# EAGLE design clock (EAGLE 6.5.0)
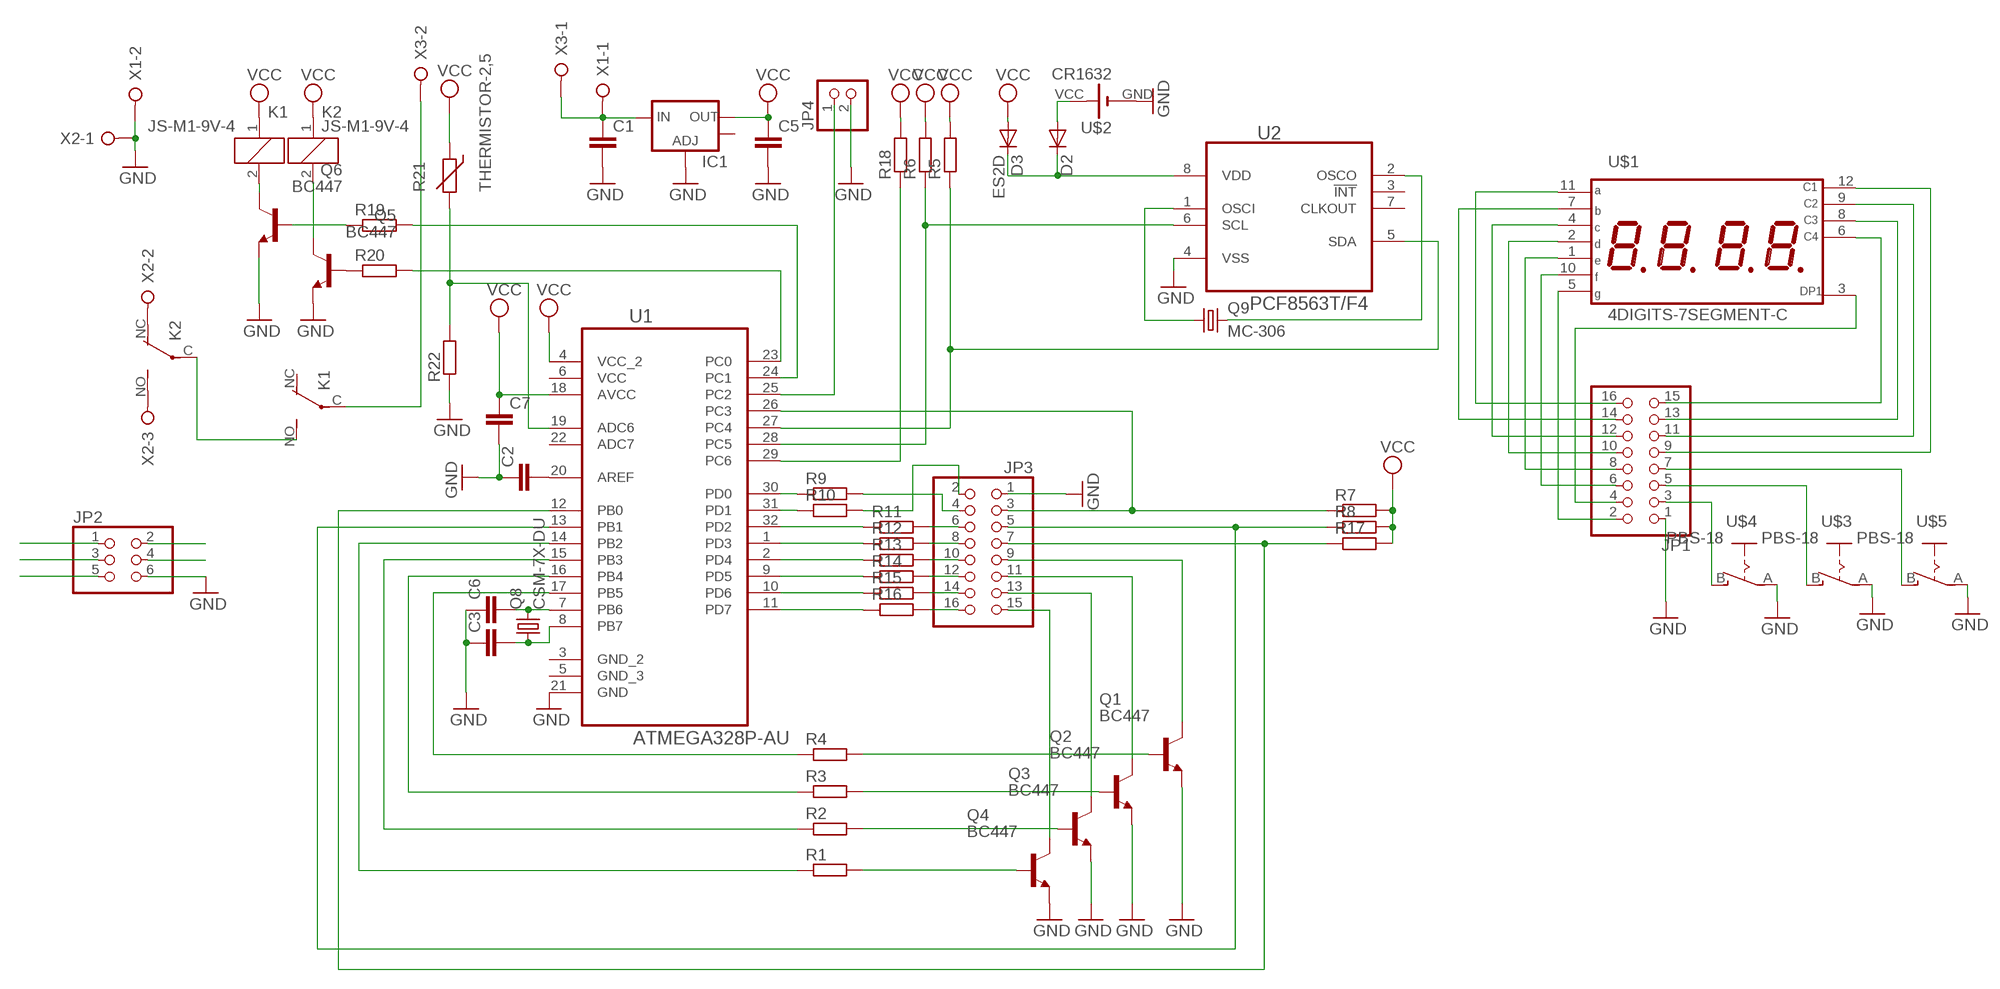
[diagram p0: schematic, sheet 1]

## Parts
C1  C-EU025-040X050  [C025-040X050]
C2  C-EUC1206  [C1206]
C3  C-EUC0805K  [C0805K]
C5  C-EU025-050X050  [C025-050X050]
C6  C-EUC0805K  [C0805K]
C7  C-EU025-040X050  [C025-040X050]
D2  DIODE-SOD80C  [SOD80C]
D3  ES2D  [SMB]
IC1  V_REG_LM1117SOT223  [SOT223]
JP1  PINHD-2X8  [2X08]
JP2  PINHD-2X3  [2X03]
JP3  PINHD-2X8  [2X08]
JP4  PINHD-1X2  [1X02]
K1  JS-M1-9V-4  [JS-M]
K2  JS-M1-9V-4  [JS-M]
Q1  BC447  [TO92-EBC]
Q2  BC447  [TO92-EBC]
Q3  BC447  [TO92-EBC]
Q4  BC447  [TO92-EBC]
Q5  BC447  [TO92-EBC]
Q6  BC447  [TO92-EBC]
Q8  CSM-7X-DU  [CSM-7X-DU]
Q9  MC-306  [MC-306]
R1  R-EU_0207/10  [0207/10]
R2  R-EU_0207/10  [0207/10]
R3  R-EU_0207/10  [0207/10]
R4  R-EU_0207/10  [0207/10]
R5  R-EU_R1206  [R1206]
R6  R-EU_R1206  [R1206]
R7  R-EU_0207/10  [0207/10]
R8  R-EU_0207/10  [0207/10]
R9  R-EU_0207/10  [0207/10]
R10  R-EU_0207/10  [0207/10]
R11  R-EU_0207/10  [0207/10]
R12  R-EU_0207/10  [0207/10]
R13  R-EU_0207/10  [0207/10]
R14  R-EU_0207/10  [0207/10]
R15  R-EU_0207/10  [0207/10]
R16  R-EU_0207/10  [0207/10]
R17  R-EU_0207/10  [0207/10]
R18  R-EU_0207/10  [0207/10]
R19  R-EU_0207/10  [0207/10]
R20  R-EU_0207/10  [0207/10]
R21  THERMISTOR-2,5  [RS-2,5]
R22  R-EU_R1206  [R1206]
U1  ATMEGA328P-AU  [QFP80P900X900X120-32N]
U2  PCF8563T/F4  [SOIC127P600X175-8N]
U$1  4DIGITS-7SEGMENT-C  [CC56-12EWA]
U$2  CR1632  [CR3232]
U$3  PBS-18  [PBS18]
U$4  PBS-18  [PBS18]
U$5  PBS-18  [PBS18]
X1  W237-02P  [W237-132]
X2  W237-3E  [W237-3E]
X3  W237-02P  [W237-132]

## Nets
GND: C1.2 C2.1 C3.1 C5.2 C6.1 C7.2 IC1.1(ADJ) JP1.1 JP2.6 JP3.1 JP4.2 Q1.E Q2.E Q3.E Q4.E Q5.E Q6.E R22.1 U1.21(GND) U2.4(VSS) U$2.GND(-) U$3.A(P) U$4.A(P) U$5.A(P) X1.2 X2.1
MISO: JP2.1 R3.1 U1.16(PB4)
MOSI: JP2.4 R2.1 U1.15(PB3)
N$1: R6.1 U1.28(PC5) U2.6(SCL)
N$2: R5.1 U1.27(PC4) U2.5(SDA)
N$3: Q5.B R20.1
N$4: Q1.B R4.2
N$5: Q2.B R3.2
N$6: Q3.B R2.2
N$7: R10.1 U1.31(PD1)
N$8: R11.1 U1.32(PD2)
N$9: R12.1 U1.1(PD3)
N$10: R13.1 U1.2(PD4)
N$11: R14.1 U1.9(PD5)
N$12: K1.C(2:P) X3.2
N$13: R15.1 U1.10(PD6)
N$14: R16.1 U1.11(PD7)
N$15: JP3.7 R17.1 U1.12(PB0)
N$16: R1.1 U1.14(PB2)
N$17: JP3.2 R10.2
N$18: Q9.1 U2.1(OSCI)
N$19: Q9.4 U2.2(OSCO)
N$20: JP3.4 R9.2
N$22: JP3.6 R11.2
N$23: JP3.8 R12.2
N$24: JP3.10 R13.2
N$25: JP3.12 R14.2
N$26: JP3.14 R15.2
N$27: JP3.16 R16.2
N$28: Q4.B R1.2
N$29: R9.1 U1.30(PD0)
N$30: C6.2 Q8.2 U1.7(PB6)
N$31: C3.2 Q8.1 U1.8(PB7)
N$32: JP1.16 U$1.11(A)
N$33: R20.2 U1.23(PC0)
N$34: R19.2 U1.24(PC1)
N$35: JP3.3 R7.1 U1.26(PC3)
N$36: R21.2 R22.2 U1.19(ADC6)
N$37: JP3.5 R8.1 U1.13(PB1)
N$38: JP3.11 Q2.C
N$39: JP3.9 Q1.C
N$40: K2.2 Q5.C
N$41: K1.2 Q6.C
N$42: K1.NO(2:S) K2.C(2:P)
N$43: D2.A U$2.VCC(+)
N$44: JP1.14 U$1.7(B)
N$45: K2.NC(2:O) X2.2
N$46: K2.NO(2:S) X2.3
N$47: Q6.B R19.1
N$49: JP1.3 U$4.B(S)
N$50: JP1.5 U$3.B(S)
N$51: JP1.7 U$5.B(S)
N$52: JP1.6 U$1.10(F)
N$53: JP1.12 U$1.4(C)
N$54: JP1.10 U$1.2(D)
N$55: JP1.8 U$1.1(E)
N$56: JP1.2 U$1.5(G)
N$57: JP1.15 U$1.6(C4)
N$58: JP1.9 U$1.12(C1)
N$59: JP1.11 U$1.9(C2)
N$60: JP1.13 U$1.8(C3)
N$61: JP1.4 U$1.3(DP1)
N$62: JP3.15 Q4.C
N$63: JP3.13 Q3.C
N$66: C2.2 U1.20(AREF)
N$67: D2.C D3.C U2.8(VDD)
N$68: JP4.1 U1.25(PC2)
N$73: C1.1 IC1.3(IN) X1.1 X3.1
RESET: JP2.5 R18.1 U1.29(PC6)
SCK: JP2.3 R4.1 U1.17(PB5)
VCC: C5.1 C7.1 D3.A IC1.2(OUT) JP2.2 K1.1 K2.1 R5.2 R6.2 R7.2 R8.2 R17.2 R18.2 R21.1 U1.4(VCC_2) U1.18(AVCC)
Unconnected: IC1.4(OUT) K1.NC(2:O) U1.3(GND_2) U1.5(GND_3) U1.22(ADC7) U2.3(!INT) U2.7(CLKOUT)

## Power pins joined to a net without a drawn wire
VCC: U1.6(VCC)

## Library data of the parts
C1-C3 C5-C7 = rcl:C-EU: CAPACITOR, European symbol
D2 = diode:DIODE-: DIODE
D3 = diode:ES2D: DIODE super fast rectifier, 2 A
IC1 = sparkfun:V_REG_LM1117: Voltage Regulator LM1117 Standard adjustable voltage regulator but in SMD form. Spark Fun Electronics SKU : COM-00595
JP1 JP3 = pinhead:PINHD-2X8: PIN HEADER
JP2 = pinhead:PINHD-2X3: PIN HEADER
JP4 = pinhead:PINHD-1X2: PIN HEADER
K1 K2 = relay:JS-M1*: Automotive Ultra-Miniature Power Relay NAiS Source: http://www.mew-europe.com/.. en_ds_61211_0000.pdf; OC_FARNELL: unknown; OC_NEWARK: unknown
Q1-Q6 = transistor-npn:BC447*: NPN Transistor
Q8 = quarz:CSM-7X-DU: SMD CRYSTAL Source: www.ecsxtal.com .. Crystal 3.6864MHz CSM_7X_DU.PDF; OC_FARNELL: unknown; OC_NEWARK: unknown
Q9 = quarz:MC-306: kHz RANGE CRYSTAL UNIT SMD Source: MC-306_405_406_E07X.PDF Homepage <www.epsontoyocom.co.jp>; MPN: MC-306 60.0KHZ 100PPM ,12.5PF; OC_FARNELL: 1278040; OC_NEWARK: 31M5576
R1-R20 R22 = rcl:R-EU_: RESISTOR, European symbol
R21 = varistor:THERMISTOR: THERMISTOR
U1 = atmega328:ATMEGA328P-AU: 8-bit Microcontroller with In-System Programmable Flash; MPN: ATMEGA328P-AU; OC_FARNELL: 1715486; OC_NEWARK: 14R4631; PACKAGE: TQFP-32; SUPPLIER: Atmel
U2 = pcf8563:PCF8563T/F4: IC, RTC/CALENDAR, SMD, 8563, SOIC8; MPN: PCF8563T/F4; OC_FARNELL: 2064561; OC_NEWARK: 71T7091; PACKAGE: SOIC-8; SUPPLIER: NXP Semiconductors
U$1 = display-kingbright:4DIGITS-7SEGMENT-C
U$2 = battery:CR1632
U$3-U$5 = switch:PBS-18
X1 X3 = con-wago-508:W237-02P: WAGO SREW CLAMP; OC_FARNELL: unknown; OC_NEWARK: unknown
X2 = con-wago-508:W237-3E: WAGO SREW CLAMP; OC_FARNELL: unknown; OC_NEWARK: unknown

## Net classes
0 default: width 0.406 mm, drill 0.406 mm, clearance 0.406 mm
1 GND: width 0.61 mm, drill 0.61 mm, clearance 0.61 mm

## Board
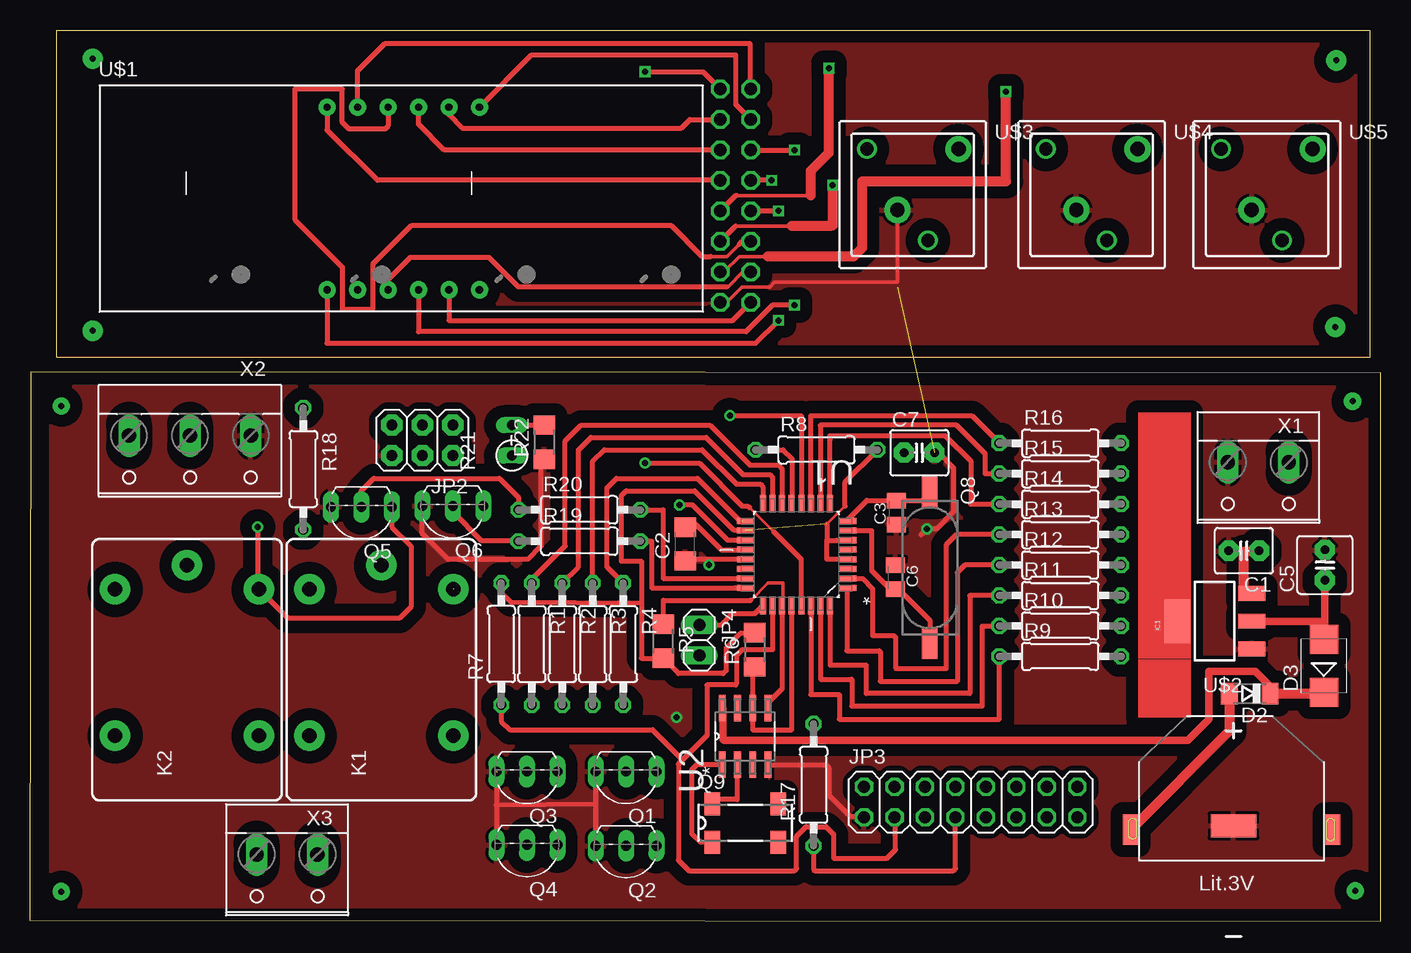
[diagram p1: board, top side]
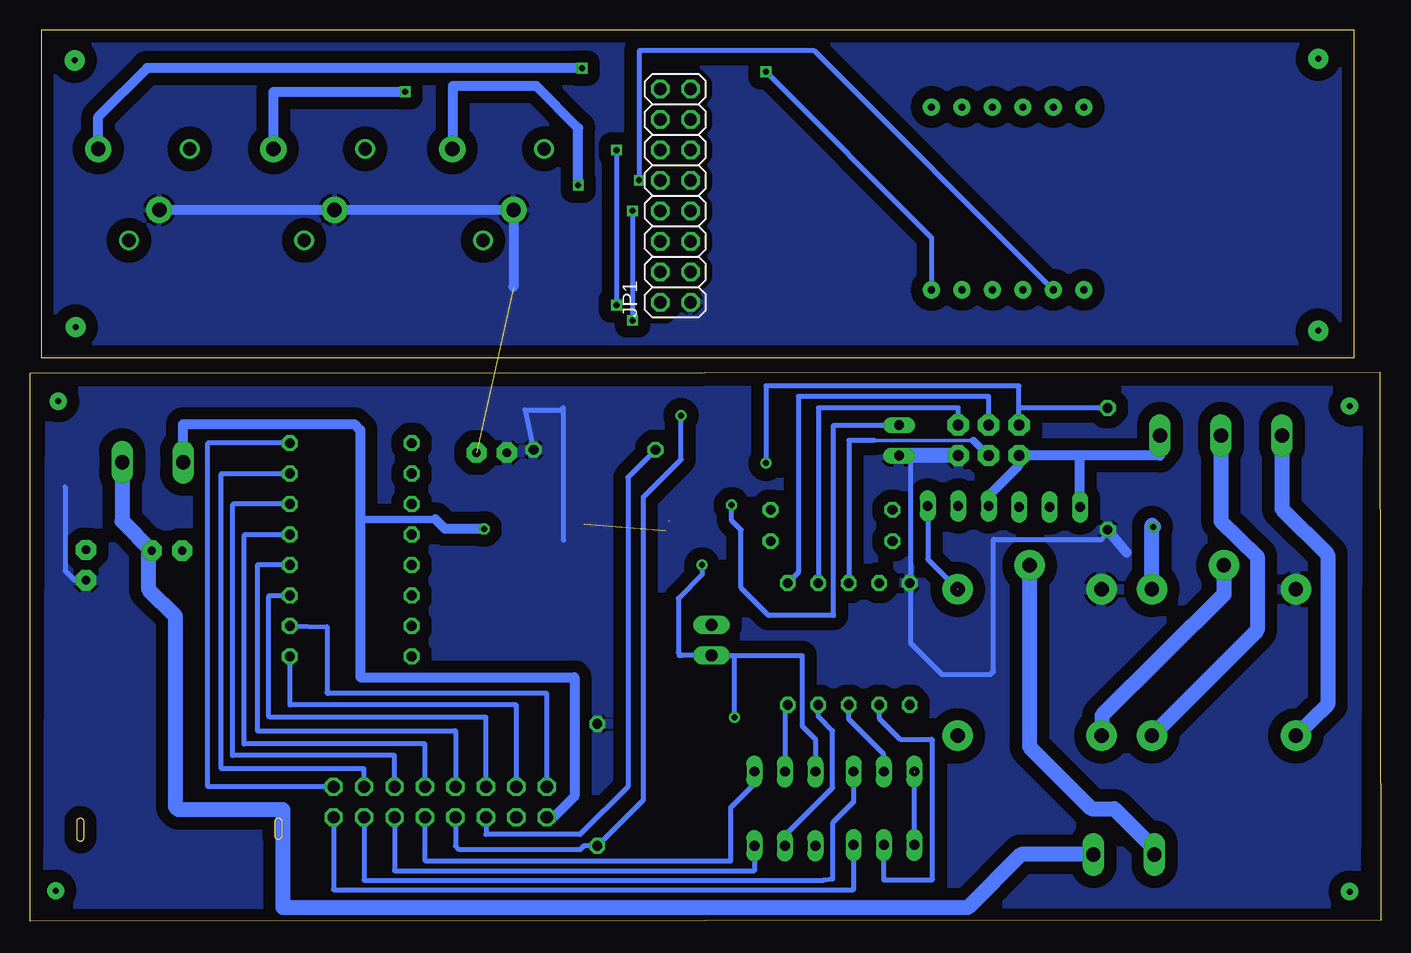
[diagram p2: board, bottom side, seen from below]

Size 112.62 x 74.3 mm. Coordinates in mm from the lower left corner, seen from the top.
Outline: 0,0.08 112.62,0 112.62,45.71 0.08,45.79 0,0.08
Outline: 2.22,46.99 2.22,74.29 111.68,74.29 111.68,46.99 2.22,46.99
Copper layers (1*16): Top 0.035mm / dielectric 1.5mm / Bottom 0.035mm
Design rules "default": minimum track width 10mil, minimum drill 24mil, track to track 8mil, track to pad 8mil, pad to pad 8mil, via to via 8mil, smd to smd 8mil, copper to edge 40mil, drill to drill 8mil, minimum pad ring 10mil, minimum via ring 8mil, stop-mask expansion 4mil, vias tented up to drill 0mil, thermal gap 10mil

### Footprints (pad centres in the part's own frame; a part is rotated, then mirrored left to right if it is on the bottom)
C025-040X050 = drill 0.7 pad 1.676 octagon: 1 -1.27,0; 2 1.27,0
C1206 = smd 1.6 x 1.8: 1 -1.4,0; 2 1.4,0
C0805K = smd 1.3 x 1.6: 1 -1,0; 2 1,0
C025-050X050 = drill 0.7 pad 1.676 octagon: 1 -1.27,0; 2 1.27,0
SOD80C = smd 1.4 x 1.8: A 1.7,0; C -1.7,0
SMB = smd 2.4 x 2.4: A 2.2,0; C -2.2,0
SOT223 = smd 1.219 x 2.235: 1 -2.311,-3.099; 2 0,-3.099; 3 2.311,-3.099 | smd 3.6 x 2.2: 4 0,3.099
2X08 = drill 1.016 octagon: 1 -8.89,-1.27; 2 -8.89,1.27; 3 -6.35,-1.27; 4 -6.35,1.27; 5 -3.81,-1.27; 6 -3.81,1.27; 7 -1.27,-1.27; 8 -1.27,1.27; 9 1.27,-1.27; 10 1.27,1.27; 11 3.81,-1.27; 12 3.81,1.27; 13 6.35,-1.27; 14 6.35,1.27; 15 8.89,-1.27; 16 8.89,1.27
2X03 = drill 0.9 pad 1.778 octagon: 1 -2.54,-1.27; 2 -2.54,1.27; 3 0,-1.27; 4 0,1.27; 5 2.54,-1.27; 6 2.54,1.27
1X02 = drill 1.016 long: 1 -1.27,0; 2 1.27,0
JS-M = drill 1.2 pad 2.54: 1 6.7,6; 2 6.7,-6; C 8.7,0; NC -5.5,-6; NO -5.5,6
TO92-EBC = drill 0.813 long: B 0,-1.27; C -2.54,-1.27; E 2.54,-1.27
CSM-7X-DU = smd 2.54 x 1.27: 1 -6.338,0; 2 6.338,0
MC-306 = smd 1.3 x 1.9: 1 -2.75,-1.6; 2 2.75,-1.6; 3 2.75,1.6; 4 -2.75,1.6
0207/10 = drill 0.813 octagon: 1 -5.08,0; 2 5.08,0
R1206 = smd 1.6 x 1.803: 1 -1.422,0; 2 1.422,0
RS-2,5 = drill 0.813 long: 1 -1.27,0; 2 1.27,0
QFP80P900X900X120-32N = smd 1.473 x 0.508: 1 -4.242,2.794; 2 -4.242,2.007; 3 -4.242,1.194; 4 -4.242,0.406; 5 -4.242,-0.406; 6 -4.242,-1.194; 7 -4.242,-2.007; 8 -4.242,-2.794; 17 4.242,-2.794; 18 4.242,-2.007; 19 4.242,-1.194; 20 4.242,-0.406; 21 4.242,0.406; 22 4.242,1.194; 23 4.242,2.007; 24 4.242,2.794 | smd 0.508 x 1.473: 9 -2.794,-4.242; 10 -2.007,-4.242; 11 -1.194,-4.242; 12 -0.406,-4.242; 13 0.406,-4.242; 14 1.194,-4.242; 15 2.007,-4.242; 16 2.794,-4.242; 25 2.794,4.242; 26 2.007,4.242; 27 1.194,4.242; 28 0.406,4.242; 29 -0.406,4.242; 30 -1.194,4.242; 31 -2.007,4.242; 32 -2.794,4.242
SOIC127P600X175-8N = smd 2.184 x 0.559: 1 -2.362,1.905; 2 -2.362,0.635; 3 -2.362,-0.635; 4 -2.362,-1.905; 5 2.362,-1.905; 6 2.362,-0.635; 7 2.362,0.635; 8 2.362,1.905
CC56-12EWA = drill 0.6 pad 1.422: 1 13.97,-5.715; 2 16.51,-5.715; 3 19.05,-5.715; 4 21.59,-5.715; 5 24.13,-5.715; 6 26.67,-5.715; 7 26.67,9.525; 8 24.13,9.525; 9 21.59,9.525; 10 19.05,9.525; 11 16.51,9.525; 12 13.97,9.525
CR3232 = smd 3.81 x 1.93: GND 0,-0.953 | smd 1.27 x 2.54: VCC -8.572,-1.27; VCC1 8.255,-1.27
PBS18 = drill 1.2 pad 2.184: A 0,0; B 5.095,5.075 | drill 1.1 pad 1.27: P$1 -2.54,5.08; P$2 2.54,-2.54
W237-132 = drill 1.194 long: 1 -2.54,-0.635; 2 2.54,-0.635
W237-3E = drill 1.194 long: 1 -5.08,-0.635; 2 0,-0.635; 3 5.08,-0.635

### Placement (x,y rotation side)
C1  101.2,30.88 180 top
C2  54.61,31.43 90 top
C3  72.23,34.05 90 top
C5  107.95,29.69 90 top
C6  72.15,28.65 270 top
C7  74.14,39.05 0 top
D2  101.68,18.97 180 top
D3  107.87,21.27 90 top
IC1  98.74,25 90 top
JP1  58.82,60.48 90 bottom
JP2  32.7,40.08 180 top
JP3  78.42,9.92 0 top
JP4  55.8,23.42 270 top
K1  29.29,20.95 90 top
K2  13.1,20.95 90 top
Q1  49.69,11.19 180 top
Q2  49.69,5 180 top
Q3  41.43,11.19 180 top
Q4  41.43,5.08 180 top
Q5  27.62,33.26 180 top
Q6  35.24,33.34 180 top
Q8  75.01,29.45 270 top
Q9  59.61,8.18 0 top
R1  41.83,23.1 270 top
R2  44.37,23.1 270 top
R3  46.91,23.1 270 top
R4  49.45,23.1 270 top
R5  52.78,23.34 270 top
R6  60.4,22.62 90 top
R7  39.29,23.1 90 top
R8  65.56,39.29 0 top
R9  85.88,22.07 0 top
R10  85.88,24.61 0 top
R11  85.88,27.15 0 top
R12  85.88,29.69 0 top
R13  85.88,32.23 0 top
R14  85.88,34.77 0 top
R15  85.88,37.31 0 top
R16  85.88,39.85 0 top
R17  65.33,11.35 90 top
R18  22.78,37.7 270 top
R19  45.8,31.67 0 top
R20  45.8,34.29 0 top
R21  40.16,40.08 90 top
R22  42.86,39.93 90 top
U1  63.9,30.56 180 top
U2  59.61,15.4 90 top
U$1  10.79,58.34 0 top
U$2  100.33,8.89 0 top
U$3  72.31,59.29 0 top
U$4  87.23,59.29 0 top
U$5  101.84,59.29 0 top
X1  102.39,37.62 180 top
X2  13.34,39.85 180 top
X3  21.43,4.92 180 top

### Tracks (layer width: path | path; a pad name or v marks a point on that pad's centre or on a via)
GND  (via drill 0.5 pad 0.41, 0.5 pad 0.61)  (2 unrouted)
  Top 0.305: JP1.1 58.1,51.59 59.37,52.86 61.67,52.86 62.07,53.26 72.31,53.26 U$3.A
  Top 0.406: 38.89,9.68 Q4.E | Q1.E 47.15,9.76 | 47.15,9.76 Q2.E | Q3.E 38.89,9.68 | 38.89,9.68 47.15,9.76 | 74.3,32.23 v74.77,32.7 75.56,32.7 76.99,34.13 76.99,37.78 75.72,39.05 C7.2 | 54.9,30.32 C2.1 54.73,30.15 56.59,30.15 | U2.4 66.34,13.04 66.6,12.78 66.6,10.48 68.34,8.73 69.45,8.73 JP3.1 | Q6.E 32.7,32.31 34.85,30.16 41.51,30.16 42.62,31.27 42.62,38.27 R22.1 | U1.21 56.59,30.15 | v56.59,29.69 56.59,30.15
  Bottom 0.406: Q1.E 47.15,15.16 48.26,16.27 48.26,22.15 53.74,22.15 | 38.89,6.27 38.89,12.38 | 58.34,22.15 JP4.2 53.74,22.15 | 58.34,22.15 58.5,22.15 | v53.9,16.99 53.9,21.99 53.74,22.15 | v56.59,29.69 56.59,28.89 58.58,26.91 58.58,22.38 58.34,22.15
  Bottom 0.61: 78.82,33.5 85.09,33.5
  Bottom 0.813: X1.2 99.85,41.43 85.57,41.43 85.09,40.96 85.09,33.5 85.09,20.32 67.23,20.32 67.23,10.4 68.98,8.65 JP3.1 | X2.1 18.41,38.81 25.08,38.81 | Q5.E 25.08,38.81 | U$5.A U$4.A U$3.A 72.31,52.86 | v74.77,32.7 78.03,32.7 78.82,33.5 | Q6.E 32.7,35.48 30.24,37.94 30.24,38.73 JP2.6 25.08,38.81
  pour Top (isolate 1.016): 1.83,44.85 111.52,44.85 111.52,0.48 1.83,0.48
  pour Bottom (isolate 1.016): 2.22,73.98 111.68,73.98 111.68,46.83 2.3,46.83 2.3,71.91
  pour Top (isolate 1.016): 2.22,74.3 111.68,74.3 111.6,47.07 2.14,47.07
MISO
  Top 0.406: U1.16 61.1,36.21 60.88,36.43 58.9,36.43 56.04,39.29 47.86,39.29 46.91,38.34 R3.1
  Bottom 0.406: JP2.1 35.24,42.78 46.91,42.78 R3.1
MOSI
  Top 0.406: U1.15 61.91,34.82 61.91,36.99 61.67,37.23 59.45,37.23 56.36,40.32 46.75,40.32 45.72,39.29 45.72,29.53 R2.1
  Bottom 0.305: 33.97,40.08 42.23,40.08
  Bottom 0.406: 42.23,40.08 44.37,40.08 R2.1
  Bottom 0.61: JP2.4 33.97,40.08
N$1
  Top 0.406: U1.28 63.5,15.95 60.25,15.95 U2.6 60.25,21.04 R6.1
N$2
  Top 0.254: 60.09,26.75 61.52,28.18
  Top 0.305: 61.52,28.18 62.79,28.18 62.79,26.64 U1.27
  Top 0.406: U1.27 62.7,19.36 61.52,18.18 U2.5 | 60.09,26.75 52.78,26.75 R5.1
N$3
  Top 0.406: Q5.B 27.62,35.88 28.65,36.91 39.13,36.91 40.72,35.32 R20.1
N$4
  Bottom 0.406: R4.2 49.69,18.02 Q1.B
N$5
  Bottom 0.406: Q2.B 49.69,7.14 45.72,11.11 45.72,15.87 46.91,17.07 R3.2
N$6
  Bottom 0.406: Q3.B 41.43,13.89 44.37,16.83 R2.2
N$7
  Top 0.406: R10.1 79.38,24.61 79.38,17.94 68.5,17.94 68.5,20.16 65.9,20.16 U1.31
N$8
  Top 0.406: R11.1 78.34,27.15 78.34,18.97 69.69,18.97 69.69,21.35 66.69,21.35 U1.32
N$9
  Top 0.406: R12.1 77.95,29.69 77.31,29.05 77.31,20 70.88,20 70.88,22.46 70.8,22.54 68.1,22.54 68.1,27.73 U1.1
N$10
  Top 0.406: 67.64,28.57 U1.2 69.4,28.55 70.25,27.7 70.25,23.81 71.99,23.81 72.15,23.65 72.15,21.11 72.23,21.03 76.36,21.03 76.36,31.35 77.23,32.23 R13.1
N$11
  Top 0.406: R14.1 78.42,34.77 78.42,38.34 76.28,40.48 66.67,40.48 66.69,40.18 U1.9
N$12
  Bottom 1.27: K1.C 29.29,14.53 24.13,9.37 22.23,9.37 18.89,6.03 X3.2
N$13
  Top 0.406: R15.1 79.61,37.31 79.61,38.97 77.23,41.35 65.88,41.35 65.88,34.9 U1.10
N$14
  Top 0.406: U1.11 65.09,41.91 65.09,42.15 78.5,42.15 R16.1
N$15  (via drill 0.5 pad 0.41)
  Top 0.406: v58.34,42.15 64.3,42.15 U1.12 | R17.1 65.33,4.29 65.41,4.21 76.99,4.21 77.15,4.37 JP3.7
  Bottom 0.406: JP3.7 77.15,6.27 76.83,5.95 66.75,5.95 66.44,6.27 R17.1 61.52,10.08 61.52,35.32 58.34,38.5 v58.34,42.15
N$16
  Top 0.406: U1.14 62.71,37.7 62.39,38.02 60,38.02 56.67,41.35 45.96,41.35 44.61,40 44.61,31.27 41.83,28.5 R1.1
N$17
  Bottom 0.406: R10.2 87.87,24.53 87.87,19.05 87.79,18.97 69.53,18.97 JP3.2
N$18
  Top 0.406: U2.1 55.58,13.04 55.17,12.62 55.17,7.3 55.88,6.59 56.85,6.59 Q9.1
N$19
  Top 0.406: U2.2 58.98,10.14 56.91,10.14 Q9.4
N$20
  Bottom 0.406: JP3.4 72.07,18.02 90.96,18.02 R9.2
N$21  (via drill 0.5 pad 1.42)
  other vias: 2.62,2.46
N$22
  Bottom 0.406: JP3.6 74.61,16.99 92.63,16.99 92.71,17.07 92.71,27.07 92.63,27.15 R11.2
N$23
  Bottom 0.406: R12.2 93.66,29.69 93.66,15.87 77.15,15.87 JP3.8
N$24
  Bottom 0.406: R13.2 94.69,32.23 94.77,32.15 94.77,14.76 79.69,14.76 JP3.10
N$25
  Bottom 0.406: JP3.12 82.23,13.81 95.73,13.81 95.73,34.69 95.65,34.77 R14.2
N$26
  Bottom 0.406: JP3.14 84.77,12.7 96.68,12.7 96.68,37.31 R15.2
N$27
  Bottom 0.406: JP3.16 97.79,11.19 97.79,39.85 R16.2
N$28
  Bottom 0.406: Q4.B 41.43,3.41 37.47,3.41 37.39,3.49 37.39,15.08 37.47,15.16 40.08,15.16 41.83,16.91 R1.2
N$29
  Top 0.406: R9.1 80.8,16.83 67.47,16.83 67.47,18.89 65.09,18.89 U1.30
N$30
  Top 0.406: Q8.2 75.01,25.08 72.44,27.65 C6.2 71.72,27.65 70.17,29.21 70.17,32.54 68.16,32.54 U1.7
N$31
  Top 0.406: U1.8 68.14,33.45 69.77,35.08 72.04,35.08 C3.2 74.98,35.05 75.01,35.08 Q8.1
N$32
  Top 0.406: U$1.11 27.3,70.88 29.61,73.18 60.01,73.18 60.01,69.45 JP1.16
N$33
  Top 0.406: U1.23 59.63,28.57 52.78,28.57 52.78,34.29 R20.2
N$34
  Top 0.406: U1.24 58.8,27.78 51.83,27.78 51.83,31.67 R19.2
N$35
  Top 0.406: U1.26 61.91,26.3 61.91,22.62 59.37,22.62 58.9,22.15 58.9,19.84 58.82,19.68 56.44,19.68 56.44,15.48 54.41,13.45 | 54.41,13.45 54.05,13.1 54.05,5.08 54.93,4.21 63.74,4.21 63.9,4.37 63.9,7.06 64.69,7.86 66.36,7.86 66.99,7.22 66.99,5.24 71.44,5.24 72.15,5.95 72.15,8.57 JP3.3 | R7.1 39.29,16.67 40.01,15.95 51.91,15.95 54.41,13.45
N$36  (via drill 0.5 pad 0.61)
  Top 0.406: U1.19 58.18,31.75 55.24,34.69 v54.13,34.69 | R21.2 42.14,41.35 R22.2
  Bottom 0.406: v54.13,34.69 54.13,33.42 53.34,32.62 53.34,27.78 51.04,25.48 45.64,25.48 45.64,41.35 R21.2
N$37
  Top 0.406: R8.1 62.79,39.29 63.5,38.58 U1.13
  Bottom 0.406: JP3.5 74.61,7.22 66.75,7.22 62.79,11.19 62.79,36.99 R8.1
N$38
  Bottom 0.406: JP3.11 82.23,4.21 52.23,4.21 Q2.C
N$39
  Bottom 0.406: Q1.C 52.23,11.43 54.21,9.45 54.21,5 79.61,5 79.69,5.08 JP3.9
N$40  (via drill 0.5 pad 0.61)
  Top 0.406: v18.97,32.86 18.97,27.78 K2.2 21.51,25.24 30.8,25.24 31.75,26.19 31.75,31.27 30.16,32.86 Q5.C
  Bottom 1.27: K2.2 19.1,32.99 v18.97,32.86
N$41  (1 unrouted)
  Bottom 0.406: Q6.C 37.78,30.16 35.32,27.7
N$42
  Bottom 1.27: K2.C 13.1,27.23 23.26,17.14 23.26,15.49 K1.NO
N$43
  Top 0.813: D2.A 99.98,15.84 U$2.VCC
N$44
  Top 0.406: U$1.7 41.83,72.23 58.82,72.23 58.82,68.1 JP1.14
N$45
  Bottom 1.27: X2.2 13.34,33.34 10.32,30.4 10.32,24.23 K2.NC
N$46
  Bottom 1.27: X2.3 8.26,34.37 4.45,30.56 4.45,18.03 K2.NO
N$47
  Top 0.406: Q6.B 35.24,34.13 37.62,31.75 40.64,31.75 R19.1
N$48  (via drill 0.5 pad 1.42)
  other vias: 110.49,2.54
N$49  (via drill 0.5 pad 0.41)
  Top 0.305: 57.86,54.13 59.13,55.4 61.52,55.4
  Top 0.406: JP1.3 57.86,54.13
  Top 0.813: v81.36,69.14 81.36,61.67 69.37,61.67 69.37,56.12 68.66,55.4 61.52,55.4
  Bottom 0.813: U$4.B 92.33,67.61 92.31,69.14 v81.36,69.14
N$50  (via drill 0.5 pad 0.41)
  Top 0.305: 58.82,57.94 63.5,57.94
  Top 0.406: JP1.5 58.82,57.94
  Top 0.813: v66.91,61.36 66.91,58.02 66.75,57.94 63.5,57.94
  Bottom 0.813: U$3.B 77.39,64.38 77.39,69.61 70.41,69.61 66.91,66.12 v66.91,61.36
N$51  (via drill 0.5 pad 0.41)
  Top 0.305: 65.09,60.48 58.9,60.48
  Top 0.406: 58.9,60.48 58.82,60.48 JP1.7
  Top 0.813: 65.09,60.48 65.09,62.55 66.6,64.06 v66.6,71.12
  Bottom 0.813: U$5.B 106.93,67.06 102.87,71.12 v66.6,71.12
N$52
  Top 0.305: 56.75,55.4 58.1,55.4 59.13,56.44
  Top 0.406: U$1.10 29.84,66.28 29.61,66.04 26.59,66.04 26.04,66.6 26.04,69.37 22.07,69.37 22.07,58.5 26.04,54.53 26.04,51.04 28.57,51.04 28.57,54.77 31.83,58.02 53.42,58.02 56.04,55.4 56.75,55.4 | 59.13,56.44 59.37,56.67 JP1.6
N$53  (via drill 0.5 pad 0.41)
  Top 0.406: JP1.12 v63.74,64.29 | v63.74,51.36 61.91,51.36 59.69,49.13 32.38,49.13 U$1.4
  Bottom 0.406: v63.74,64.29 v63.74,51.36
N$54  (via drill 0.5 pad 0.41)
  Top 0.406: v61.83,61.75 JP1.10
  Bottom 0.406: v61.83,61.75 61.83,72.55 47.23,72.55 U$1.2
N$55  (via drill 0.5 pad 0.41)
  Top 0.406: U$1.1 24.77,48.18 60.48,48.18 v62.39,50.09 | JP1.8 v62.39,59.21
  Bottom 0.406: v62.39,59.21 v62.39,50.09
N$56
  Top 0.406: JP1.2 58.58,50.09 34.93,50.09 U$1.5
N$57  (via drill 0.5 pad 0.41)
  Top 0.406: v51.28,70.8 56.12,70.8 JP1.15
  Bottom 0.406: v51.28,70.8 37.47,56.99 U$1.6
N$58
  Top 0.406: U$1.12 24.77,65.96 28.97,61.75 JP1.9
N$59
  Top 0.406: JP1.11 34.53,64.29 32.38,66.44 U$1.9
N$60
  Top 0.406: U$1.8 34.93,67.23 36.04,66.12 54.29,66.12 55.01,66.83 JP1.13
N$61
  Top 0.305: 58.1,52.86 58.18,52.86 59.45,54.13 JP1.4
  Top 0.406: U$1.3 29.84,53.5 31.67,55.32 38.26,55.32 40.72,52.86 58.1,52.86
N$62
  Bottom 0.406: JP3.15 87.31,2.62 43.97,2.62 Q4.C
N$63
  Bottom 0.406: JP3.13 84.77,3.41 46.43,3.41 45.72,3.49 45.72,8.18 43.97,9.92 Q3.C
N$64  (via drill 0.5 pad 1.42)
  other vias: 2.62,42.94
N$65  (via drill 0.5 pad 1.42)
  other vias: 110.25,43.34
N$66
  Top 0.406: C2.2 54.48,33.07 55.51,33.07 57.63,30.96 U1.20
N$67
  Top 0.406: 103.35,19 D2.C
  Top 0.61: 103.35,19 103.35,19.61 102.16,20.8 98.27,20.8 98.27,16.83 96.52,15.08 57.86,15.08 57.78,15.16 57.78,17.68 U2.8
  Top 0.813: D2.C 107.77,18.97 D3.C
N$68
  Top 0.406: JP4.1 57.63,24.69 58.58,25.64 60.42,25.64 U1.25
N$69  (via drill 0.5 pad 1.68)
  other vias: 5.24,71.91
N$70  (via drill 0.5 pad 1.68)
  other vias: 5.24,49.21
N$71  (via drill 0.5 pad 1.68)
  other vias: 108.82,49.53
N$72  (via drill 0.5 pad 1.68)
  other vias: 108.9,71.76
N$73
  Top 0.406: IC1.3 101.2,27.39
  Top 0.813: 101.2,27.39 101.2,30.8 C1.1
  Bottom 0.813: 102.55,30.56 C1.1
  Bottom 1.27: X1.1 104.93,33.34 C1.1 102.71,30.64 102.71,27.62 100.49,25.4 100.49,9.52 100.25,9.29 91.52,9.29 91.52,1.11 34.45,1.11 30,5.56 X3.1
RESET  (via drill 0.5 pad 0.61)
  Top 0.254: 61.99,32.46 60.01,34.45
  Top 0.406: U1.29 64.3,30.15 61.99,32.46 | 60.01,34.45 59.85,34.61 59.37,34.61 55.8,38.18 v51.28,38.18
  Bottom 0.406: R18.1 30.16,42.78 | JP2.5 30.16,42.78 | 30.16,42.78 30.16,44.61 51.28,44.61 v51.28,38.18
SCK  (1 unrouted)
  Top 0.406: 59.36,33.35 U1.17 59.64,33.34 | 59.37,33.42 59.13,33.42 55.64,36.91 48.89,36.91 48.1,36.12 48.1,29.53 R4.1
  Bottom 0.406: JP2.3 32.7,43.74 48.58,43.74 48.58,29.05 R4.1
VCC  (1 unrouted)
  Top 0.254: 67.95,34.61 66.44,33.1
  Top 0.406: R7.2 39.29,27.38 40.08,26.59 50.96,26.51 | 66.44,33.1 66.44,31.75 | 66.44,31.75 67.27,31.75 U1.6 | 50.96,26.51 50.96,30 49.29,30 49.29,35.48 49.69,35.88 55.4,35.88 58.66,32.62 59.6,32.62 U1.18 | 60.33,23.97 R6.2 59.68,23.96 59.21,23.96 58.02,22.78 58.02,20.88 57.78,20.64 54.06,20.64 R5.2 50.96,21.91 50.96,26.51 | 67.95,34.61 67.95,36.59 R8.2 | U1.4 66.45,30.15 66.44,30.16 66.44,31.75
  Top 0.61: C5.1 107.95,25.08 | 107.95,25.08 107.95,23.55 D3.A | IC1.2 107.87,25 107.95,25.08
  Bottom 0.406: C5.1 108.9,28.42 109.7,29.21 109.7,36.19 | R8.2 71.36,42.62 68.34,42.62 68.18,42.78 68.18,31.8 U1.6 | R18.2 23.26,31.83 32.31,31.83 32.31,20.8 32.54,20.56 36.59,20.56 39.21,23.18 39.21,38.66 39.05,38.81
  Bottom 0.813: 21.19,30.72 R18.2
  Bottom 1.27: JP2.2 39.05,38.81 R21.1
  pour Bottom (isolate 1.016): 1.91,44.21 110.97,44.13 111.12,0.48 2.06,0.56
(copper drawn outside any net)
  shapes: Top area x2